# EAGLE design tick-mini-mk-2.1 (EAGLE 6.5.0)
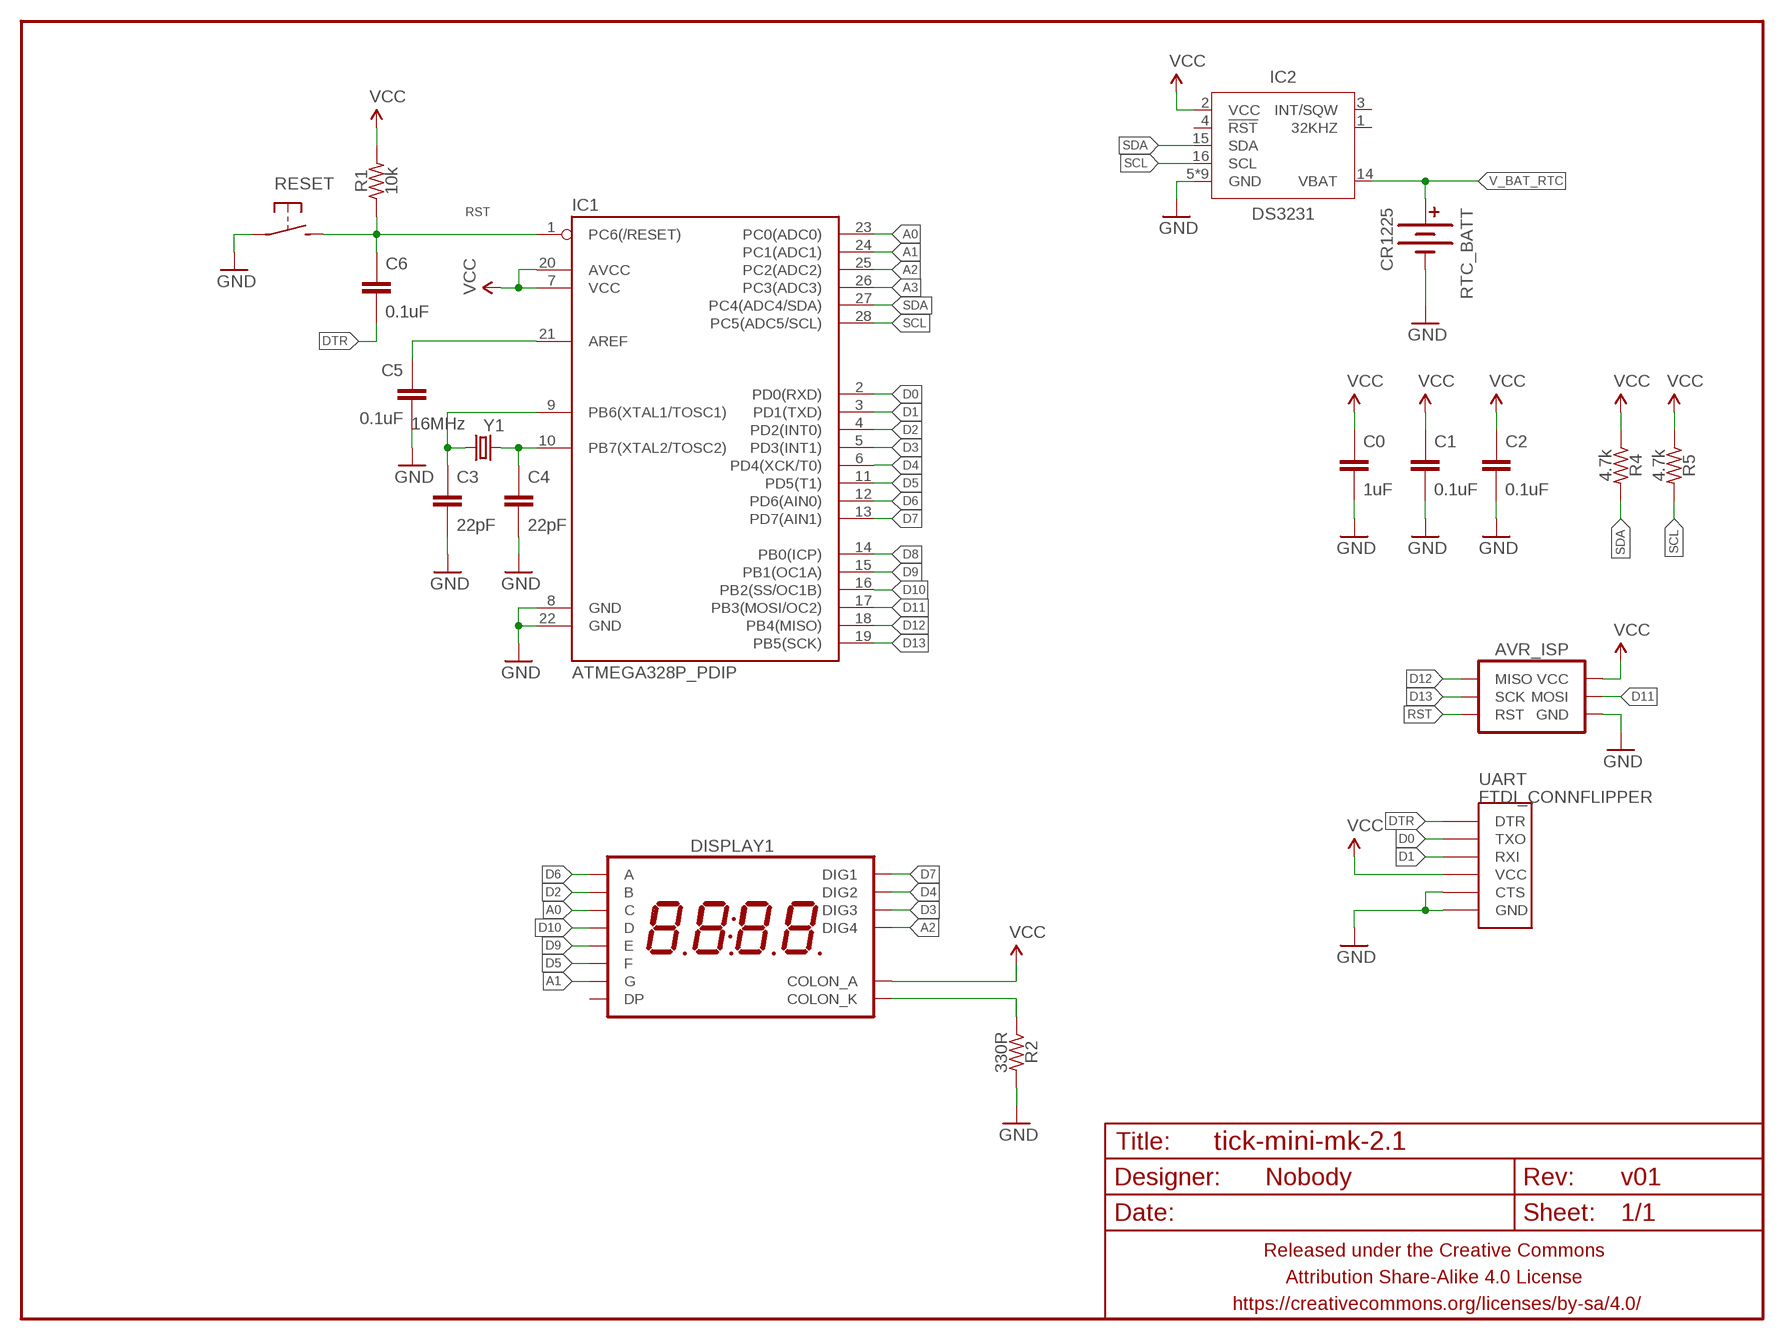
[diagram p0: schematic, sheet 1]

## Parts
AVR_ISP  AVR_SPI_PRG_6INLINE  [AVR_MINI_PROG]
C0  1uF  CAPACITOR-CERAMIC025-024X044  [C025-024X044]
C1  0.1uF  CAPACITOR-CERAMIC025-024X044  [C025-024X044]
C2  0.1uF  CAPACITOR-CERAMIC025-024X044  [C025-024X044]
C3  22pF  CAPACITOR-CERAMIC025-024X044  [C025-024X044]
C4  22pF  CAPACITOR-CERAMIC025-024X044  [C025-024X044]
C5  0.1uF  CAPACITOR-CERAMIC025-024X044  [C025-024X044]
C6  0.1uF  CAPACITOR-CERAMIC025-024X044  [C025-024X044]
DISPLAY1  7SEG_4DIGIT_COLON14.2MM-CC-NS  [7SEG_4DIG_NS]
FRAME1  FRAME-LETTERNO_PACKAGE  [DUMMY]
IC1  ATMEGA328P_PDIP  [DIL28-3]
IC2  DS3231  [SO16W]
R1  10k  RESISTORPTH-AXIAL-7.62MM  [RESISTOR-AXIAL-PTH-7.62MM]
R2  330R  RESISTORPTH-AXIAL-7.62MM  [RESISTOR-AXIAL-PTH-7.62MM]
R4  4.7k  RESISTORPTH-AXIAL-7.62MM  [RESISTOR-AXIAL-PTH-7.62MM]
R5  4.7k  RESISTORPTH-AXIAL-7.62MM  [RESISTOR-AXIAL-PTH-7.62MM]
RESET  SPST-NO-TACT3MM-RA  [TACTILE-PTH-SIDE]
RTC_BATT  CR1225  BATTERY12MM  [BATTCON_12MM]
UART  FTDI_CONNFLIPPER  [FTDI_CONN_FLIP]
Y1  16MHz  CRYSTALHC49UV  [HC49U-V]

## Nets
A0: DISPLAY1.P$4(C) IC1.23(PC0(ADC0))
A1: DISPLAY1.P$5(G) IC1.24(PC1(ADC1))
A2: DISPLAY1.P$6(DIG4) IC1.25(PC2(ADC2))
A3: IC1.26(PC3(ADC3))
D0: IC1.2(PD0(RXD)) UART.TXO
D1: IC1.3(PD1(TXD)) UART.RXI
D2: DISPLAY1.P$9(B) IC1.4(PD2(INT0))
D3: DISPLAY1.P$10(DIG3) IC1.5(PD3(INT1))
D4: DISPLAY1.P$11(DIG2) IC1.6(PD4(XCK/T0))
D5: DISPLAY1.P$12(F) IC1.11(PD5(T1))
D6: DISPLAY1.P$13(A) IC1.12(PD6(AIN0))
D7: DISPLAY1.P$14(DIG1) IC1.13(PD7(AIN1))
D8: IC1.14(PB0(ICP))
D9: DISPLAY1.P$1(E) IC1.15(PB1(OC1A))
D10: DISPLAY1.P$2(D) IC1.16(PB2(SS/OC1B))
D11: AVR_ISP.4(MOSI) IC1.17(PB3(MOSI/OC2))
D12: AVR_ISP.1(MISO) IC1.18(PB4(MISO))
D13: AVR_ISP.3(SCK) IC1.19(PB5(SCK))
DTR: C6.2 UART.DTR
GND: AVR_ISP.6(GND) C0.2 C1.2 C2.2 C3.2 C4.2 C5.2 IC1.8(GND) IC1.22(GND) IC2.5(GND) IC2.6(GND) IC2.7(GND) IC2.8(GND) IC2.9(GND) IC2.10(GND) IC2.11(GND) IC2.12(GND) IC2.13(GND) R2.P$2 RESET.1 RTC_BATT.GND(-) UART.CTS UART.GND
N$1: C4.1 IC1.10(PB7(XTAL2/TOSC2)) Y1.1
N$2: C3.1 IC1.9(PB6(XTAL1/TOSC1)) Y1.2
N$3: C5.1 IC1.21(AREF)
N$4: DISPLAY1.P$7(COLON_K) R2.P$1
RST: AVR_ISP.5(RST) C6.1 IC1.1(PC6(/RESET)) R1.P$1 RESET.2
SCL: IC1.28(PC5(ADC5/SCL)) IC2.16(SCL) R5.P$2
SDA: IC1.27(PC4(ADC4/SDA)) IC2.15(SDA) R4.P$2
V_BAT_RTC: IC2.14(VBAT) RTC_BATT.PWR@1(+)
VCC: AVR_ISP.2(VCC) C0.1 C1.1 C2.1 DISPLAY1.P$8(COLON_A) IC1.7(VCC) IC1.20(AVCC) IC2.2(VCC) R1.P$2 R4.P$1 R5.P$1 UART.VCC
Unconnected: DISPLAY1.P$3(DP) IC2.1(32KHZ) IC2.3(INT/SQW) IC2.4(!RST)

## Library data of the parts
AVR_ISP = A_butts:AVR_SPI_PRG_6: AVR ISP 6 Pin This is the reduced ISP connector for AVR programming. Common on Arduino. This footprint will take up less PCB space and can be used with a 10-pin to 6-pin adapter such as SKU: BOB-08508 **Special note about "TEST_POINT" package. The stop mask is on the top side, so if you want your programming test points to be on the bottom of your board, make sure to place this package on the bottom side of the board. This also ensure that the orientation to program from the bottom side will be correct.
C0 C1-C6 = A_butts:CAPACITOR-CERAMIC: CAPACITOR, European symbol
DISPLAY1 = A_butts:7SEG_4DIGIT_COLON
FRAME1 = A_butts:FRAME-LETTER: Schematic Frame Standard 8.5x11 US Letter frame; DESIGNER: Nobody; VERSION: v01
IC1 = A_butts:ATMEGA328P_PDIP: uC used in the Arduino 32kb flash, 1k EEPROM, 2k SRAM This is the through-hole version of this chip.
IC2 = A_butts:DS3231
R1 R2 R4 R5 = A_butts:RESISTOR: RESISTOR, American symbol
RESET = A_butts:SPST-NO-TACT
RTC_BATT = A_butts:BATTERY: Battery Holders Various common sizes : AA, AAA, 20mm coin cell and 12mm coin cell. 20MM_4LEGS, BATT-10373
UART = A_butts:FTDI_CONN: Connector which mates to FTDI basic or FTDI cable.
Y1 = A_butts:CRYSTAL: Various standard crystals. Proven footprints. Spark Fun Electronics SKU : COM-00534

## Board
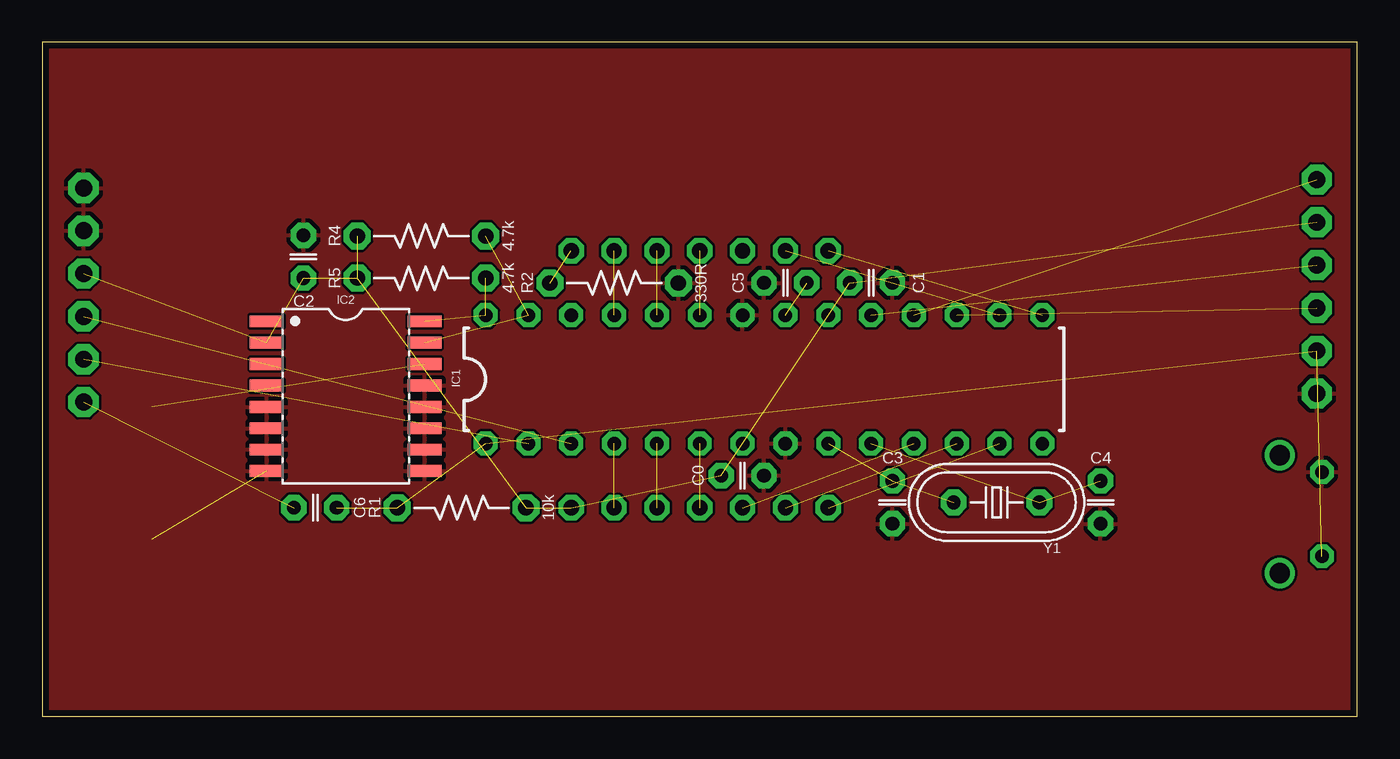
[diagram p1: board, top side]
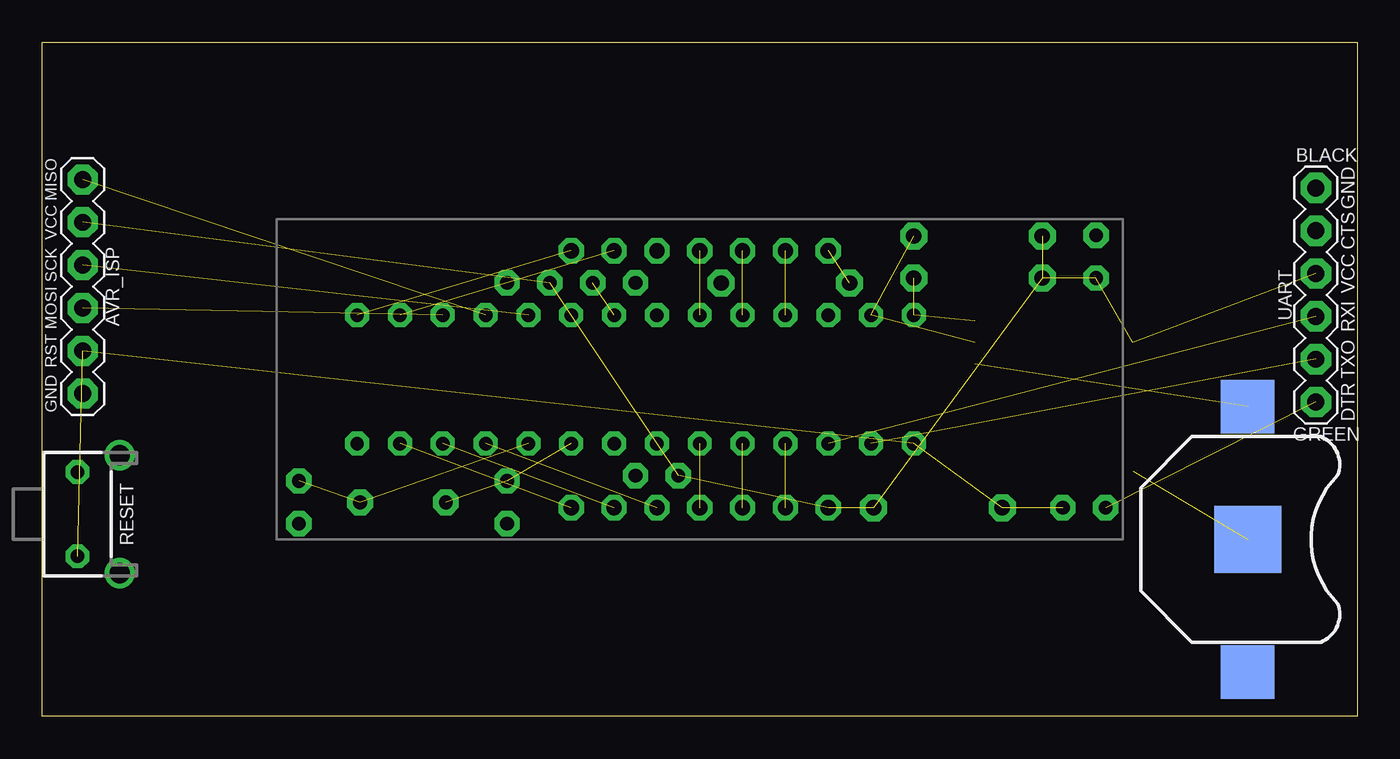
[diagram p2: board, bottom side, seen from below]

Size 78 x 40 mm. Coordinates in mm from the lower left corner, seen from the top.
Outline: 78,0 78,40 0,40 0,0 78,0
Copper layers (1*16): Top 0.0356mm / dielectric 1.5011mm / Bottom 0.0356mm
Design rules "LaenPCBOrder_2": minimum track width 6mil, minimum drill 13mil, track to track 6mil, track to pad 6mil, pad to pad 6mil, via to via 6mil, smd to smd 6mil, copper to edge 15mil, drill to drill 6mil, minimum pad ring 7mil, minimum via ring 7mil, stop-mask expansion 3mil, vias tented up to drill 20mil, thermal gap 10mil

### Footprints (pad centres in the part's own frame; a part is rotated, then mirrored left to right if it is on the bottom)
AVR_MINI_PROG = drill 1 pad 1.778 octagon: 1 -6.35,0; 2 -3.81,0; 3 -1.27,0; 4 1.27,0; 5 3.81,0; 6 6.35,0.01
C025-024X044 = drill 0.813 pad 1.5 octagon: 1 -1.27,0; 2 1.27,0
7SEG_4DIG_NS = drill 0.9 pad 1.5 octagon: P$1 -7.62,7.62; P$2 -5.08,7.62; P$3 -2.54,7.62; P$4 0,7.62; P$5 2.54,7.62; P$6 5.08,7.62; P$7 7.62,7.62; P$8 7.62,-7.62; P$9 5.08,-7.62; P$10 2.54,-7.62; P$11 0,-7.62; P$12 -2.54,-7.62; P$13 -5.08,-7.62; P$14 -7.62,-7.62
DIL28-3 = drill 0.8 pad 1.422 octagon: 1 -16.51,-3.81; 2 -13.97,-3.81; 3 -11.43,-3.81; 4 -8.89,-3.81; 5 -6.35,-3.81; 6 -3.81,-3.81; 7 -1.27,-3.81; 8 1.27,-3.81; 9 3.81,-3.81; 10 6.35,-3.81; 11 8.89,-3.81; 12 11.43,-3.81; 13 13.97,-3.81; 14 16.51,-3.81; 15 16.51,3.81; 16 13.97,3.81; 17 11.43,3.81; 18 8.89,3.81; 19 6.35,3.81; 20 3.81,3.81; 21 1.27,3.81; 22 -1.27,3.81; 23 -3.81,3.81; 24 -6.35,3.81; 25 -8.89,3.81; 26 -11.43,3.81; 27 -13.97,3.81; 28 -16.51,3.81
SO16W = smd 0.7 x 2: 1 -4.445,-4.685; 2 -3.175,-4.685; 3 -1.905,-4.685; 4 -0.635,-4.685; 5 0.635,-4.685; 6 1.905,-4.685; 7 3.175,-4.685; 8 4.445,-4.685; 9 4.445,4.685; 10 3.175,4.685; 11 1.905,4.685; 12 0.635,4.685; 13 -0.635,4.685; 14 -1.905,4.685; 15 -3.175,4.685; 16 -4.445,4.685
RESISTOR-AXIAL-PTH-7.62MM = drill 0.9 pad 1.6 octagon: P$1 -3.81,0; P$2 3.81,0
TACTILE-PTH-SIDE = drill 0.8 pad 1.4 octagon: 1 -2.5,0; 2 2.5,0 | drill 1.2 pad 1.778: ANCHOR1 -3.5,2.5; ANCHOR2 3.5,2.5
BATTCON_12MM = smd 3.962 x 3.962: GND 0,0 | smd 3.175 x 3.175: PWR@1 -7.874,0; PWR@2 7.874,0
FTDI_CONN_FLIP = drill 1 pad 1.8 octagon: CTS 3.81,0; DTR -6.35,0; GND 6.35,0; RXI -1.27,0; TXO -3.81,0; VCC 1.27,0
HC49U-V = drill 0.813 pad 1.524 octagon: 1 -2.54,0; 2 2.54,0

### Placement (x,y rotation side)
AVR_ISP  75.6,25.5 270 bottom
C0  41.54,14.29 0 top
C1  49.16,25.71 0 top
C2  15.5,27.27 90 top
C3  50.43,12.7 270 top
C4  62.77,12.7 270 top
C5  44.08,25.71 180 top
C6  16.2,12.38 180 top
DISPLAY1  39,20 0 bottom
FRAME1  0,0 0 top
IC1  42.81,20 0 top
IC2  18,19 270 top
R1  24.88,12.38 0 top
R2  33.92,25.71 0 top
R4  22.5,28.5 0 top
R5  22.5,26 0 top
RESET  75.9,12 270 bottom
RTC_BATT  6.5,10.5 270 bottom
UART  2.46,25 90 bottom
Y1  56.6,12.7 180 top

### Tracks (layer width: path | path; a pad name or v marks a point on that pad's centre or on a via)
A0  (1 unrouted)
A1  (1 unrouted)
A2  (1 unrouted)
D0  (1 unrouted)
D1  (1 unrouted)
D2  (1 unrouted)
D3  (1 unrouted)
D4  (1 unrouted)
D5  (1 unrouted)
D6  (1 unrouted)
D7  (1 unrouted)
D9  (1 unrouted)
D10  (1 unrouted)
D11  (1 unrouted)
D12  (1 unrouted)
D13  (1 unrouted)
DTR  (1 unrouted)
GND  (1 unrouted)
  pour Top: -0.1,40.1 78.1,40.1 78.1,-0.1 -0.1,-0.1
N$1  (2 unrouted)
N$2  (2 unrouted)
N$3  (1 unrouted)
N$4  (1 unrouted)
RST  (4 unrouted)
SCL  (2 unrouted)
SDA  (2 unrouted)
V_BAT_RTC  (1 unrouted)
VCC  (11 unrouted)